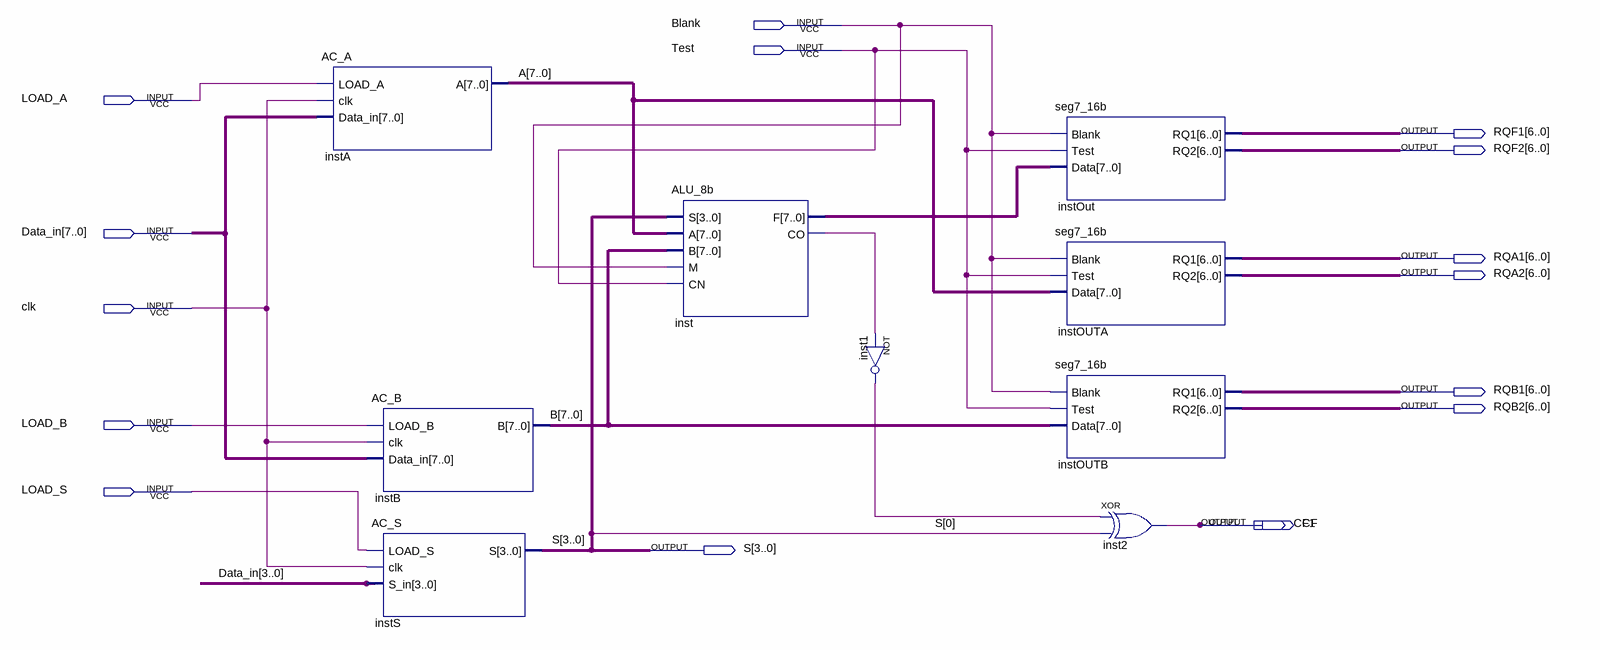
[diagram p0: schematic sheet]
// Quartus schematic ALU.bdf as structural Verilog: 9 symbols, 16 pins
module ALU (
  input  Blank,
  input  Test,
  input  LOAD_A,
  input  [7:0] Data_in,
  input  clk,
  input  LOAD_B,
  input  LOAD_S,
  output [6:0] RQF1,
  output [6:0] RQF2,
  output [6:0] RQA1,
  output [6:0] RQA2,
  output [6:0] RQB1,
  output [6:0] RQB2,
  output CF1,
  output CF,
  output [3:0] S
);

  wire inst1_out, inst_co;
  wire [7:0] A, B, inst_f;

  AC_A instA (.LOAD_A(LOAD_A), .clk(clk), .Data_in(Data_in), .A(A));
  AC_B instB (.LOAD_B(LOAD_B), .clk(clk), .Data_in(Data_in), .B(B));
  AC_S instS (.LOAD_S(LOAD_S), .clk(clk), .S_in(Data_in[3:0]), .S(S));
  ALU_8b inst (.S(S), .A(A), .B(B), .M(Blank), .CN(Test), .F(inst_f), .CO(inst_co));
  not inst1 (inst1_out, inst_co);
  seg7_16b instOut (.Blank(Blank), .Test(Test), .Data(inst_f), .RQ1(RQF1), .RQ2(RQF2));
  seg7_16b instOUTA (.Blank(Blank), .Test(Test), .Data(A), .RQ1(RQA1), .RQ2(RQA2));
  seg7_16b instOUTB (.Blank(Blank), .Test(Test), .Data(B), .RQ1(RQB1), .RQ2(RQB2));
  xor inst2 (CF, inst1_out, S[0]);

  assign CF1 = CF;
endmodule
